# EAGLE design SMMB (EAGLE 9.3.1)
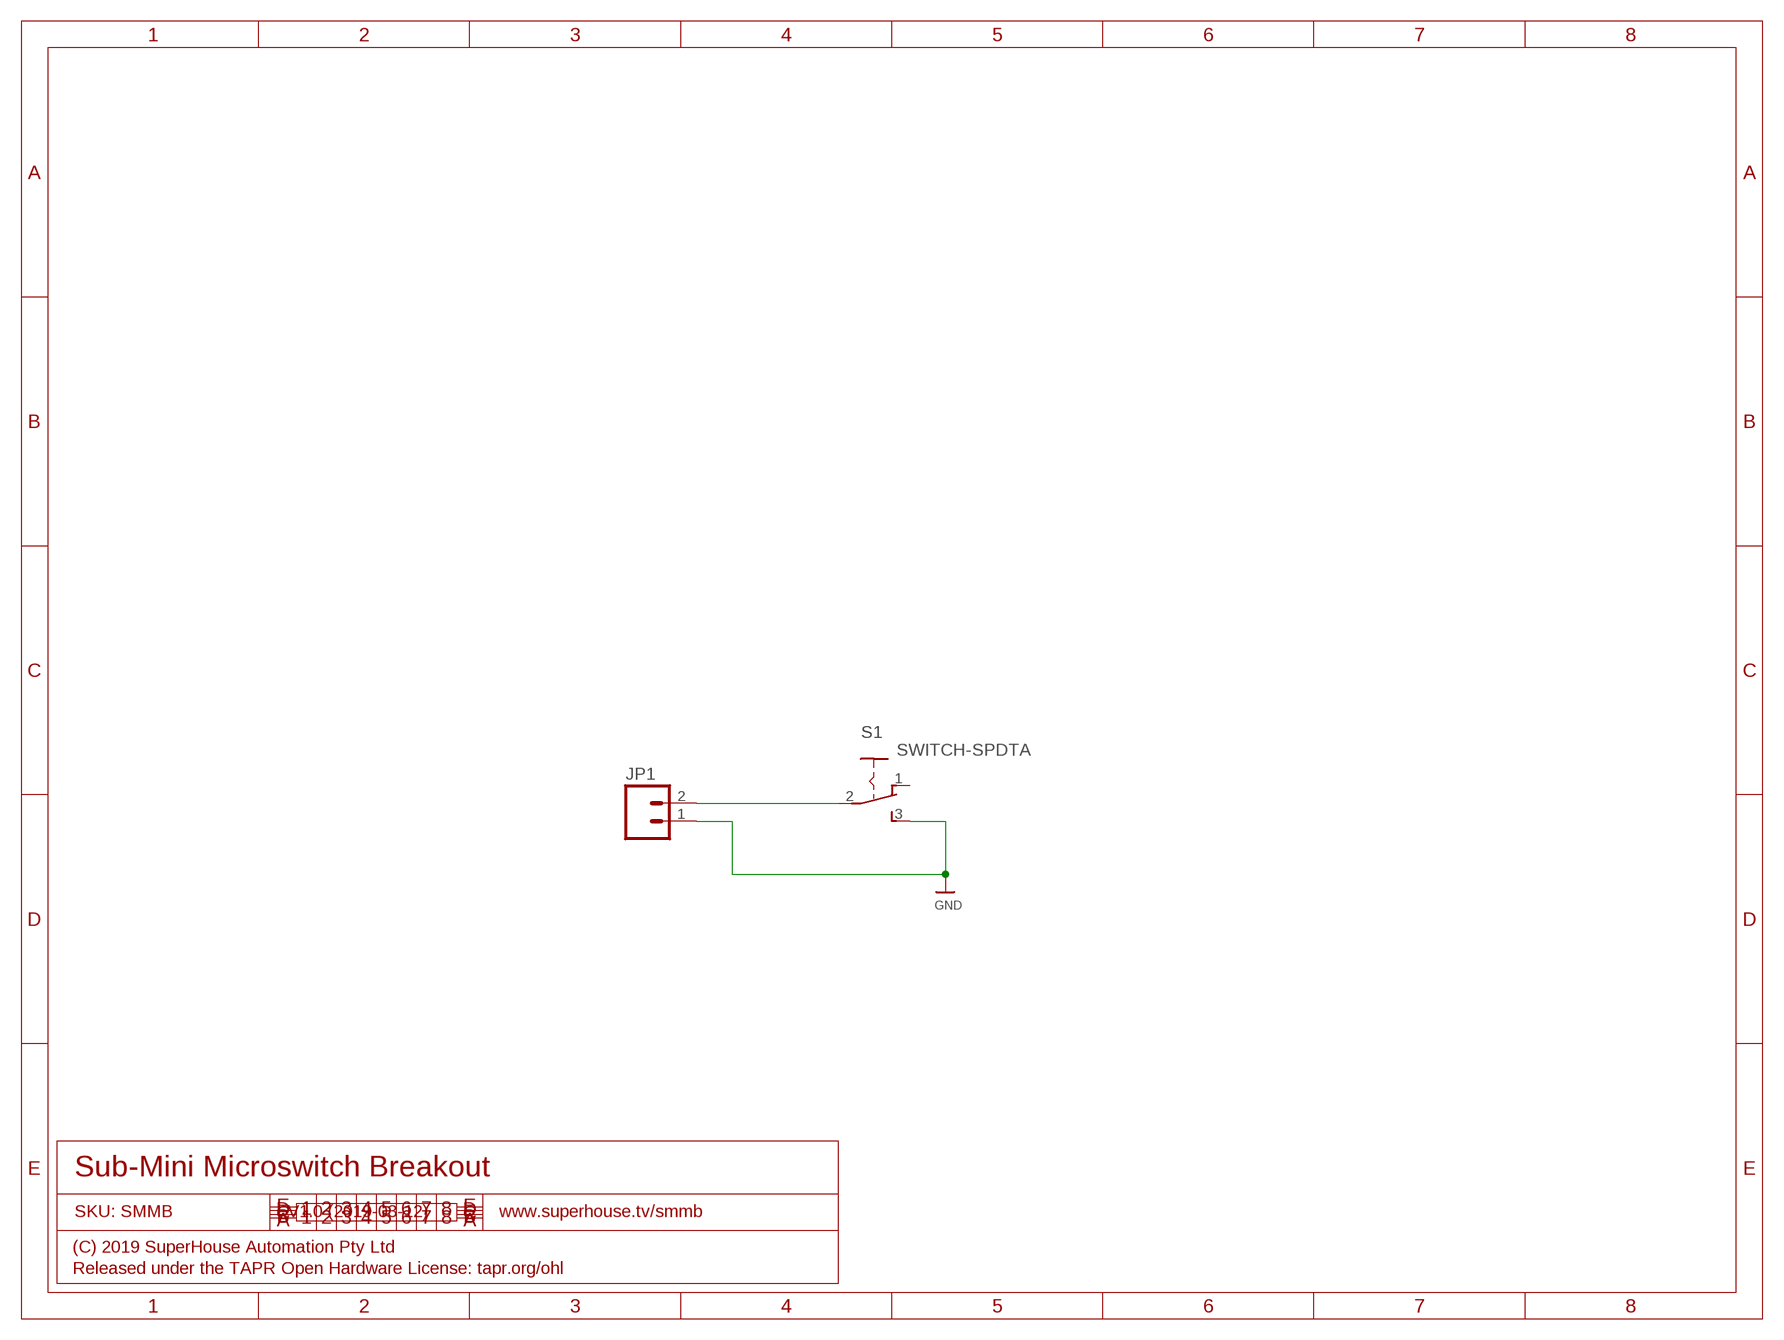
[diagram p0: schematic, sheet 1]

## Parts
JP1  M02PTH  [1X02]
S1  SWITCH-SPDTA  [SS-12F100]

## Nets
GND: JP1.1 S1.3
PAD: JP1.2 S1.2
Unconnected: S1.1

## Notes on the sheet
- Sub-Mini Microswitch Breakout
- SKU: SMMB | V1.0 (2019-03-12) | www.superhouse.tv/smmb
- (C) 2019 SuperHouse Automation Pty Ltd
- Released under the TAPR Open Hardware License: tapr.org/ohl

## Library data of the parts
JP1 = freetronics-jon:M02: Header 2 Standard 2-pin 0.1" header. Use with straight break away headers (SKU : PRT-00116), right angle break away headers (PRT-00553), swiss pins (PRT-00743), machine pins (PRT-00117), and female headers (PRT-00115). Molex polarized connector foot print use with SKU : PRT-08233 with associated crimp pins and housings.
S1 = freetronics-jon:SWITCH-SPDT

## Board
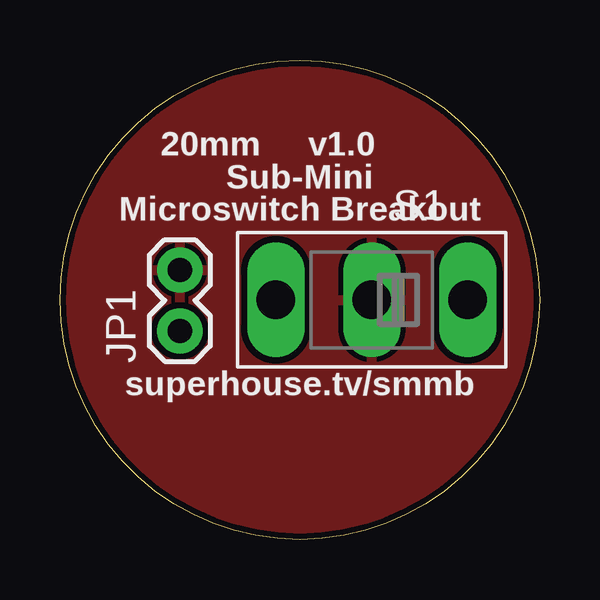
[diagram p1: board, top side]
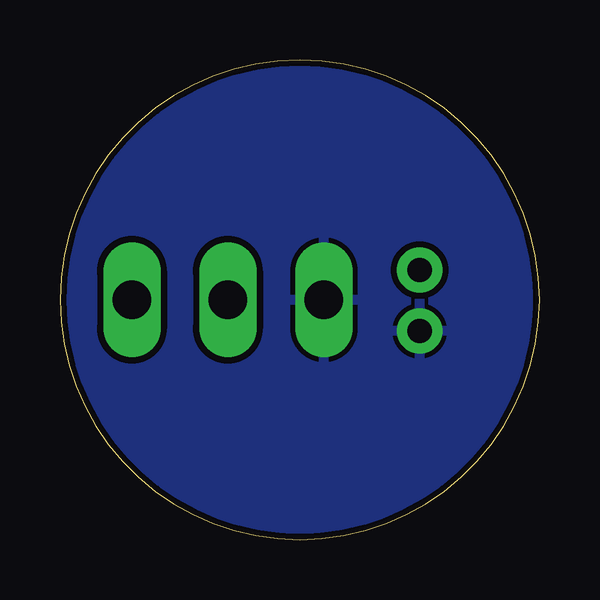
[diagram p2: board, bottom side, seen from below]

Size 20 x 20 mm. Coordinates in mm from the lower left corner, seen from the top.
Outline: 0,10 arc-90 10,20 arc-90 20,10 arc-90 10,0 arc-90 0,10
Copper layers (1*16): Top 0.035mm / dielectric 1.5mm / Bottom 0.035mm
Design rules "default *": minimum track width 8mil, minimum drill 0.4mm, track to track 8mil, track to pad 8mil, pad to pad 8mil, via to via 8mil, smd to smd 8mil, copper to edge 10mil, drill to drill 8mil, minimum pad ring 8mil, minimum via ring 10mil, stop-mask expansion 3mil, vias tented up to drill 25mil, thermal gap 8mil

### Footprints (pad centres in the part's own frame; a part is rotated, then mirrored left to right if it is on the bottom)
1X02 = drill 1.016 pad 1.88: 1 0,0; 2 2.54,0
SS-12F100 = drill 1.6 long: 1 -4,0; 2 0,0; 3 4,0

### Placement (x,y rotation side)
JP1  5,8.7 90 top
S1  13,10 180 top

### Tracks (layer width: path | path; a pad name or v marks a point on that pad's centre or on a via)
GND
  pour Bottom (isolate 0.254): 10,20 arc-90 20,10 arc-90 10,0 arc-90 0,10 arc-90
PAD
  pour Top (isolate 0.254): 10,20 arc-90 20,10 arc-90 10,0 arc-90 0,10 arc-90

### Text on the board
tPlace: 20mm v1.0 | Sub-Mini / Microswitch Breakout | superhouse.tv/smmb